# EAGLE schematic OpAmp-Inverting-3Transistor-alt3 (EAGLE 7.2.0)
Build an op amp with three discrete transistors Lyle Williams -December 01, 2011 http://www.edn.com/design/components-and-packaging/4368741/Build-an-op-amp-with-three-discrete-transistors
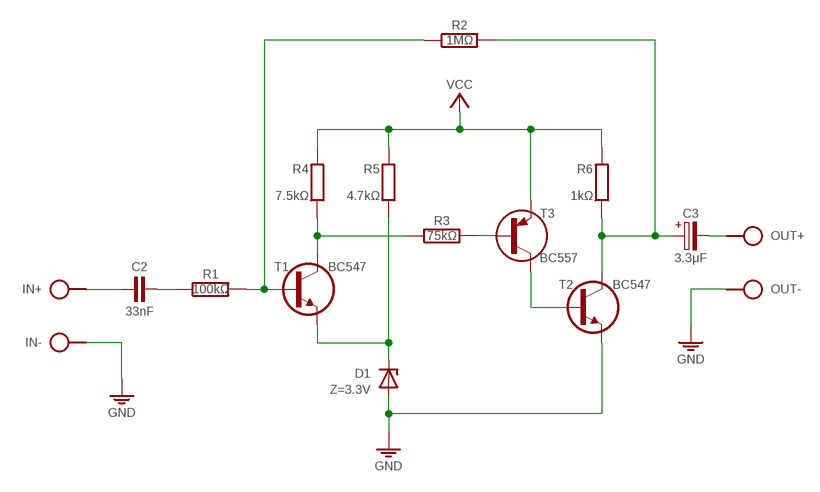
[diagram p0: schematic, sheet 1]

## Parts
C2  33nF  C050-020X044  [C050-020X044]
C3  3.3μF  CPOLE2,5-4/V  [E2.5-4/V]
D1  Z=3.3V  Z-DIODE34Z2,5  [DO34Z2,5]
IN  SPAD+--+  [SPAD-+]
J1  VCC_GNDPWR-R  [PWR-R]
OUT  SPAD+-+-  [SPAD+-]
R1  100kΩ  R-H0204/10-V  [0204/10-V]
R2  1MΩ  R-H0204/10  [0204/10]
R3  75kΩ  R-H0204/10  [0204/10]
R4  7.5kΩ  R0204/10  [0204/10]
R5  4.7kΩ  R0204/10  [0204/10]
R6  1kΩ  R0204/10-V  [0204/10-V]
T1  BC547  BC547CBE  [TO92-CBE]
T2  BC547  BC547CBE  [TO92-CBE]
T3  BC557  BC557CBE  [TO92-CBE]

## Nets
GND: D1.A IN.1 J1.1 OUT.1 T2.E
N$1: D1.C R5.2 T1.E
N$2: R3.1 R4.2 T1.C
N$3: T2.B T3.C
N$4: C2.2 IN.2
N$5: C2.1 R1.1
N$6: R1.2 R2.1 T1.B
N$7: R3.2 T3.B
N$8: C3.+ R2.2 R6.2 T2.C
N$9: C3.- OUT.2
VCC: J1.2 R4.1 R5.1 R6.1 T3.E

## Library data of the parts
C2 = c:C: CAPACITOR, European symbol
C3 = c:CPOL: POLARIZED CAPACITOR, European symbol
D1 = d:Z-DIODE
IN OUT = pad:SPAD+-
J1 = pad:VCC_GND
R1-R3 = r:R-H
R4-R6 = r:R: RESISTOR, European symbol
T1 T2 = t:BC547
T3 = t:BC557